# Altium schematic sheet Power.SchDoc: Power
size A3; ApprovedBy: Diogo Gomes; CheckedBy: Bruno, Candido, Pedro; Author: João Vieira; CompanyName: LART; DrawnBy: João Vieira; Organization: LART; Address1: Morro do lena; Address2: Alto Do Vieiro; Address3: APT 4163, Building D; Revision: v1.4.2; SheetNumber: 8; SheetTotal: 12; ProjectTitle: Autonomous Control Unit; CheckedBy1: G. Candido; CheckedBy2: F. Chen; CheckedBy3: P. Ferreira; CheckedBy4: B. Vicente; CheckedBy5: _; CheckedBy6: _; CheckedBy7: _; CHK_APP_DATE: --/--/--; DSN_APP_DATE: --/--/--; ENG_APP_DATE: --/--/--; Summary: Includes the various reference voltages needed to power all the chips in the ACU; version_tag: 1.4.2; SPICEModelCacheBATJKBWV: <root> / <DocumentId>BATJKBWV</DocumentId> / <CacheFrame Number="0"> / <Model Name="1280_74477005_5.6u" Kind="CKT"> / <Text>******* / .subckt 1280_74477005_5.6u 1 2 / Rp 1 2 5511 / Cp 1 2 8p / Rs 1 N3 0.0105 / L1 N3 2 5.464u / .ends 1280_74477005_5.6u</Text> / </Model> / <Model Name="865060440001_10uf" Kind="CKT"> / <Text>******* / .subckt 865060440001_10uF 1 2 / Rser 1 3 1.81968584275 / Lser 2 4 1.435032181E-09 / C1 3 4 0.00001 / Rpar 3 4 8333333.33333333 / .ends 865060440001_10uF</Text> / </Model> / </CacheFrame> / </root>; ImagePath: C:\Users\micron\Desktop
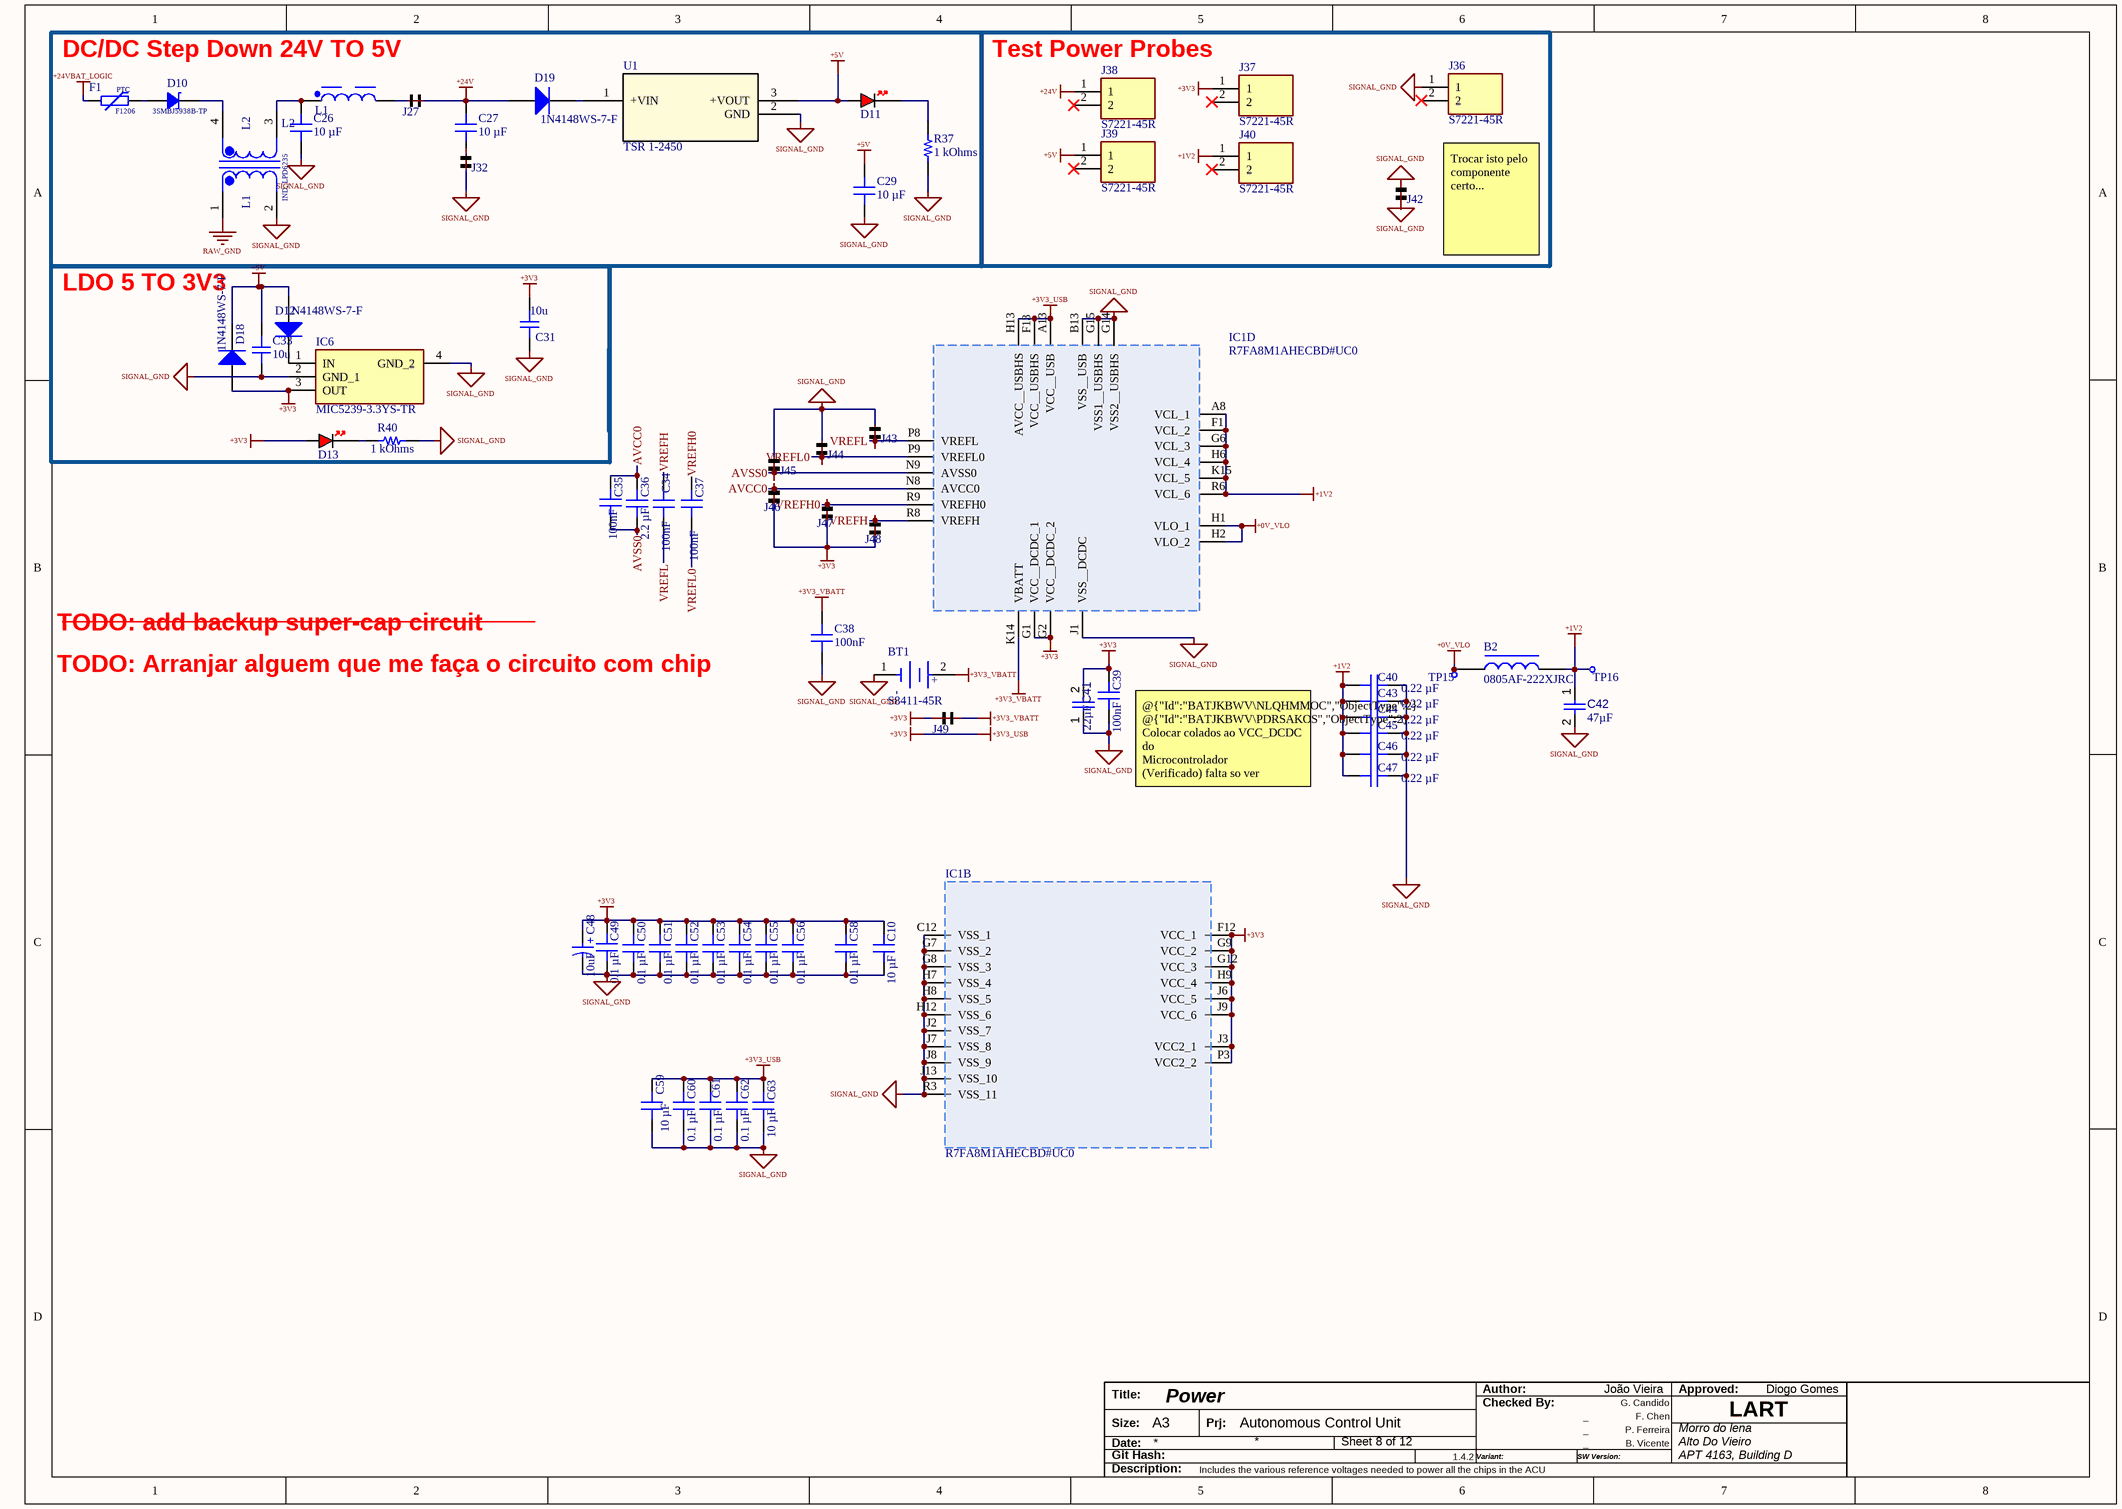
[diagram p0: Power.SchDoc]

## Parts
B2  0805AF-222XJRC  [INDC2317X152N]
BT1  S8411-45R  [FP-S8411-45R-MFG]
C10  value 10 µF  [CAP 0805_2012]  (hidden comment: 0.1uF 0805)
C26  10 µF  [CAP 0805_2012]
C27  10 µF  [CAP 0805_2012]
C29  10 µF  [CAP 0805_2012]
C31  10u  [CAP_0805]
C33  10u  [CAP_0805]
C34  value 100nF  [CAP 0805_2012]  (hidden comment: 0.1uF)
C35  value 100nF  [CAP 0805_2012]  (hidden comment: 0.1uF)
C36  value 2.2 µF  [CAP 0805_2012]  (hidden comment: 2.2uF)
C37  value 100nF  [CAP 0805_2012]  (hidden comment: 0.1uF)
C38  value 100nF  [CAP 0805_2012]  (hidden comment: 0.1uF)
C39  value 100nF  [CAP 0805_2012]  (hidden comment: 0.1uF)
C40  0.22 µF  [CAP 0201_0603]
C41  value 22µF  [CAPC0805(2012)145_L]  (hidden comment: Capacitor 22µF +/-40% 16V 0805)
C42  value 47µF  [CAPC0805(2012)145_L]  (hidden comment: 47uF)
C43  0.22 µF  [CAP 0201_0603]
C44  0.22 µF  [CAP 0201_0603]
C45  0.22 µF  [CAP 0201_0603]
C46  0.22 µF  [CAP 0201_0603]
C47  0.22 µF  [CAP 0201_0603]
C48  10uF  [WCAP-ASLL_D4H5.5]
C49  0.1 µF  [CAP 0201_0603]
C50  0.1 µF  [CAP 0201_0603]
C51  0.1 µF  [CAP 0201_0603]
C52  0.1 µF  [CAP 0201_0603]
C53  0.1 µF  [CAP 0201_0603]
C54  0.1 µF  [CAP 0201_0603]
C55  0.1 µF  [CAP 0201_0603]
C56  0.1 µF  [CAP 0201_0603]
C58  0.1 µF  [CAP 0201_0603]
C59  value 10 µF  [CAP 0805_2012]  (hidden comment: 10uF)
C60  0.1 µF  [CAP 0201_0603]
C61  0.1 µF  [CAP 0201_0603]
C62  0.1 µF  [CAP 0201_0603]
C63  value 10 µF  [CAP 0805_2012]  (hidden comment: 10uF)
D10  3SMBJ5938B-TP  [DO214AA SMB]
D11  RED  [LED_0603_RED]  (value not drawn)
D12  1N4148WS-7-F  [DIOD-SOD323-2-A_V]
D13  RED  [LED_0603_RED]  (value not drawn)
D18  1N4148WS-7-F  [DIOD-SOD323-2-A_V]
D19  1N4148WS-7-F  [DIOD-SOD323-2-A_V]
F1  F1206  [FUSE_1206]
IC1  R7FA8M1AHECBD#UC0  [RA8M1_BGA]  (parts B,D of 6)
IC6  MIC5239-3.3YS-TR  [SOT230P700X180-4N]
J27  A solder Bridge  [Solder Bridge 805]  (value not drawn)
J32  A solder Bridge  [Solder Bridge 805]  (value not drawn)
J36  S7221-45R  [S722145R]
J37  S7221-45R  [S722145R]
J38  S7221-45R  [S722145R]
J39  S7221-45R  [S722145R]
J40  S7221-45R  [S722145R]
J42  A solder Bridge  [Solder Bridge 805]  (value not drawn)
J43  A solder Bridge  [Solder Bridge 805]  (value not drawn)
J44  A solder Bridge  [Solder Bridge 805]  (value not drawn)
J45  A solder Bridge  [Solder Bridge 805]  (value not drawn)
J46  A solder Bridge  [Solder Bridge 805]  (value not drawn)
J47  A solder Bridge  [Solder Bridge 805]  (value not drawn)
J48  A solder Bridge  [Solder Bridge 805]  (value not drawn)
J49  A solder Bridge  [Solder Bridge 805 Open]  (value not drawn)
L1  5.6uH, 8.7A  [WE-PD_1280]  (value not drawn)
L2  IND_LPD6235  [IND_LPD6235]
R37  1 kOhms  [RES 0805_2012]
R40  1 kOhms  [RES 0805_2012]
TP15  TestPad  [Test Pad Small]  (value not drawn)
TP16  TestPad  [Test Pad Small]  (value not drawn)
U1  TSR 1-2450  [TSR1-SINGLE_TRP]

## Blocks framed on the sheet
DC/DC Step Down 24V TO 5V: C26 C27 C29 D10 D11 D19 F1 J27 J32 L1 L2 R37 U1
Test Power Probes: J36-J40 J42
LDO 5 TO 3V3: C31 C33 D12 D13 D18 IC6 R40

## Nets
+0V_VLO: B2.1 IC1.H1(VLO_1) IC1.H2(VLO_2) TP15.P2
+1V2: B2.2 C40.1 C42.1 C43.1 C44.1 C45.1 C46.1 C47.1 IC1.A8(VCL_1) IC1.F1(VCL_2) IC1.G6(VCL_3) IC1.H6(VCL_4) IC1.K15(VCL_5) IC1.R6(VCL_6) J40.1 TP16.P2
+3V3: C10.2 C31.2 C39.2 C41.2 C48.1(P) C49.2 C50.2 C51.2 C52.2 C53.2 C54.2 C55.2 C56.2 C58.2 C59.2 C60.2 C61.2 C62.2 C63.2 D13.A D18.1(A) IC1.A13(VCC__USB) IC1.F12(VCC_1) IC1.F13(VCC__USBHS) IC1.G1(VCC__DCDC_1) IC1.G2(VCC__DCDC_2) IC1.G9(VCC_2) IC1.G12(VCC_3) IC1.H9(VCC_4) IC1.H13(AVCC__USBHS) IC1.J3(VCC2_1) IC1.J6(VCC_5) IC1.J9(VCC_6) IC1.P3(VCC2_2) IC6.3(OUT) J37.1 J46.P0 J47.P0 J48.P0 J49.P0  [also labelled +3V3_USB]
+3V3_VBATT: BT1.2(A) C38.2 IC1.K14(VBATT) J49.P1
+5V: C29.2 C33.2 D11.A D12.1(A) D18.2(K) J39.1 U1.3(+VOUT)
+24V: C27.2 D19.1(A) J27.P0 J38.1
+24VBAT_LOGIC: F1.1
RAW_GND: L2.1
SIGNAL_GND: BT1.1(C) C10.1 C26.1 C29.1 C31.1 C33.1 C38.1 C39.1 C40.2 C41.1 C42.2 C43.2 C44.2 C45.2 C46.2 C47.2 C48.2(N) C49.1 C50.1 C51.1 C52.1 C53.1 C54.1 C55.1 C56.1 C58.1 C59.1 C60.1 C61.1 C62.1 C63.1 IC1.B13(VSS__USB) IC1.C12(VSS_1) IC1.G7(VSS_2) IC1.G8(VSS_3) IC1.G14(VSS2__USBHS) IC1.G15(VSS1__USBHS) IC1.H7(VSS_4) IC1.H8(VSS_5) IC1.H12(VSS_6) IC1.J1(VSS__DCDC) IC1.J2(VSS_7) IC1.J7(VSS_8) IC1.J8(VSS_9) IC1.J13(VSS_10) IC1.R3(VSS_11) IC6.2(GND_1) IC6.4(GND_2) J32.P0 J36.1 J42.P0 J42.P1 J43.P1 J44.P1 J45.P1 L2.2 R37.1 R40.2 U1.2(GND)
AVCC0: C35.2 C36.2 IC1.N8(AVCC0) J46.P1
AVSS0: C35.1 C36.1 IC1.N9(AVSS0) J45.P0
VREFH: C34.2 IC1.R8(VREFH) J48.P1
VREFH0: C37.2 IC1.R9(VREFH0) J47.P1
VREFL: C34.1 IC1.P8(VREFL) J43.P0
VREFL0: C37.1 IC1.P9(VREFL0) J44.P0
NetC26_2: C26.2 L1.1 L2.3
NetC27_1: C27.1 J32.P1
NetD10_1: D10.1 F1.2
NetD10_2: D10.2 L2.4
NetD11_K: D11.K R37.2
NetD12_2: D12.2(K) IC6.1(IN)
NetD13_K: D13.K R40.1
NetD19_2: D19.2(K) U1.1(+VIN)
NetJ27_P1: J27.P1 L1.2

Not connected (* = marked no-connect by the designer): J36 2*; J37 2*; J38 2*; J39 2*; J40 2*

## Notes on the sheet
- Trocar isto pelo componente certo...
- TODO: add backup super-cap circuit
- TODO: Arranjar alguem que me faça o circuito com chip
- (near C39) @{"Id":"BATJKBWV\NLQHMMOC","ObjectType":2} @{"Id":"BATJKBWV\PDRSAKOS","ObjectType":2} Colocar colados ao VCC_DCDC do
  Microcontrolador
  (Verificado) falta so ver datasheet para ver se foi erro da renesas
- Title:
- Author:
- Checked By:
- Approved:
- Size:
- Date:
- Git Hash:
- A3
- Prj:
- Variant:
- SW Version:
- Description:
- (in symbol 865060440001) +
- (in symbol CMP-00029-00001-1) +; -
- (in symbol FUSE_PPTC_1206) PTC
- (in symbol IND_LPD6235) L1

## Library data of the parts
B2 = 0805AF-222XJRC: COILCRAFT - 0805AF-222XJRC - Wirewound Inductor, 2.2 H, 0.98 ohm, 105 MHz, 350 mA, 0805 [2012 Metric], 0805AF Series; Geometry.Height: 1.52mm; Manufacturer_Name: COILCRAFT; Manufacturer_Part_Number: 0805AF-222XJRC; Mouser Part Number: *; Mouser Price/Stock: *; Arrow Part Number: *; Arrow Price/Stock: *; Datasheet Link: https://4donline.ihs.com/images/VipMasterIC/IC/COLC/COLC-S-A0013795668/COLC-S-A0013956448-1.pdf?hkey=6D3A4C79FDBF58556ACFDE234799DDF0
BT1 = CMP-00029-00001-1: Batteries/Accessories; RoHS Compliant: Yes
C10 C59 C63 = C2012X7R1A106K125AE: CAP CER 10UF 10V X7R 0805; manufacturer: TDK Corporation; Tolerance: ±10%; Part Number: C2012X7R1A106K125AE; Applications: Boardflex Sensitive; Capacitance: 10 µF; componentlink1description: Datasheet; componentlink1url: https://product.tdk.com/info/en/catalog/datasheets/mlcc_commercial_soft_en.pdf?ref_disty=digikey; componentlink2description: DigiKey Link; componentlink2url: https://www.digikey.com/en/products/detail/tdk-corporation/C2012X7R1A106K125AE/5809181; Device Package: 0805 (2012 Metric); Features: Soft Termination; lastupdated: 30/01/2024 20:15:17; Lifecycle Status: Active; Minimum Order: 1; Mounting Type: Surface Mount, MLCC; Operating Temperature: -55°C ~ 125°C; Package / Case: 0805 (2012 Metric); packaging: TapeAndReel; partid: 3036; Part Status: Active; price: 0.07; series: C; Size / Dimension: 0.079" L x 0.049" W (2.00mm x 1.25mm); Supplier 1: DigiKey; Supplier Part Number 1: 445-173616-1-ND; Temperature Coefficient: X7R; Thickness (Max): 0.059" (1.50mm); Voltage - Rated: 10V
C26 C27 C29 = CL21Y106KPQVPNE: CAP CER 10UF 10V X7S 0805; manufacturer: Samsung Electro-Mechanics; Tolerance: ±10%; Part Number: CL21Y106KPQVPNE; Value: 10 µF; Applications: Automotive; Capacitance: 10 µF; componentlink1description: Datasheet; componentlink1url: http://www.samsungsem.com/kr/support/product-search/mlcc/CL21Y106KPQVPNE.jsp; componentlink2description: DigiKey Link; componentlink2url: https://www.digikey.com/en/products/detail/samsung-electro-mechanics/CL21Y106KPQVPNE/5961169; Device Package: 0805 (2012 Metric); lastupdated: 06/02/2024 20:15:48; Lifecycle Status: Active; Minimum Order: 1; Mounting Type: Surface Mount, MLCC; Operating Temperature: -55°C ~ 125°C; Package / Case: 0805 (2012 Metric); packaging: TapeAndReel; partid: 2979; Part Status: Active; price: 0.06; Ratings: AEC-Q200; series: CL; Size / Dimension: 0.079" L x 0.049" W (2.00mm x 1.25mm); Supplier 1: DigiKey; Supplier Part Number 1: 1276-6685-1-ND; Temperature Coefficient: X7S; Thickness (Max): 0.055" (1.40mm); Voltage - Rated: 10V
C31 C33 = CAP_0805_10V: Capacitor SMD 0805 10V
C34 C35 C37-C39 = C2012X7R1A106K125AE: CAP CER 10UF 10V X7R 0805; manufacturer: TDK Corporation; Capacitance: 10 µF; Tolerance: ±10%; Part Number: C2012X7R1A106K125AE; Applications: Boardflex Sensitive; componentlink1description: Datasheet; componentlink1url: https://product.tdk.com/info/en/catalog/datasheets/mlcc_commercial_soft_en.pdf?ref_disty=digikey; componentlink2description: DigiKey Link; componentlink2url: https://www.digikey.com/en/products/detail/tdk-corporation/C2012X7R1A106K125AE/5809181; Device Package: 0805 (2012 Metric); Features: Soft Termination; lastupdated: 30/01/2024 20:15:17; Lifecycle Status: Active; Minimum Order: 1; Mounting Type: Surface Mount, MLCC; Operating Temperature: -55°C ~ 125°C; Package / Case: 0805 (2012 Metric); packaging: TapeAndReel; partid: 3036; Part Status: Active; price: 0.07; series: C; Size / Dimension: 0.079" L x 0.049" W (2.00mm x 1.25mm); Supplier 1: DigiKey; Supplier Part Number 1: 445-173616-1-ND; Temperature Coefficient: X7R; Thickness (Max): 0.059" (1.50mm); Voltage - Rated: 10V
C36 = VJ0805V225MXQTW1BC: CAP CER 2.2UF 10V Y5V 0805; manufacturer: Vishay Vitramon; Temperature Coefficient: Y5V (F); Tolerance: ±20%; Part Number: VJ0805V225MXQTW1BC; Applications: General Purpose; Capacitance: 2.2 µF; componentlink1description: Datasheet; componentlink1url: https://www.vishay.com/docs/28548/vjw1bcbascomseries.pdf; componentlink2description: DigiKey Link; componentlink2url: https://www.digikey.com/en/products/detail/vishay-vitramon/VJ0805V225MXQTW1BC/8310634; Device Package: 0805 (2012 Metric); lastupdated: 04/02/2024 20:15:35; Lifecycle Status: Active; Minimum Order: 1; Mounting Type: Surface Mount, MLCC; Operating Temperature: -25°C ~ 85°C; Package / Case: 0805 (2012 Metric); packaging: TapeAndReel; partid: 26419; Part Status: Active; price: 0.06; series: VJ; Size / Dimension: 0.079" L x 0.049" W (2.00mm x 1.25mm); Supplier 1: DigiKey; Supplier Part Number 1: 720-VJ0805V225MXQTW1BCCT-ND; Thickness (Max): 0.053" (1.35mm); Voltage - Rated: 10V
C40 C43-C47 = GMC02X5R224K16NT: CAP0201 X5R .22UF 10% 16V; manufacturer: Cal-Chip Electronics, Inc.; Value: 0.22 µF; Tolerance: ±10%; Part Number: GMC02X5R224K16NT; Applications: General Purpose; Capacitance: 0.22 µF; componentlink1description: Datasheet; componentlink1url: https://calchip.com/wp-content/uploads/2024/02/gmc_series-1.pdf; componentlink2description: DigiKey Link; componentlink2url: https://www.digikey.com/en/products/detail/cal-chip-electronics-inc/GMC02X5R224K16NT/22562848; Device Package: 0201 (0603 Metric); lastupdated: 04/06/2024 19:00:50; Lifecycle Status: Active; Minimum Order: 1; Mounting Type: Surface Mount, MLCC; Operating Temperature: -55°C ~ 85°C; Package / Case: 0201 (0603 Metric); packaging: TapeAndReel; partid: 57532; price: 0.01; series: GMC; Size / Dimension: 0.024" L x 0.012" W (0.60mm x 0.30mm); Supplier 1: DigiKey; Supplier Part Number 1: 4713-GMC02X5R224K16NTCT-ND; Temperature Coefficient: X5R; Thickness (Max): 0.013" (0.33mm); Voltage - Rated: 16V
C41 = CMP-001-00081-4: Chip Capacitor, 22µF +/-40%, 16V, 0805, Thickness 1.45 mm; Tolerance: 5%; Voltage Rating: 16V; Mounting Technology: SMT; Pins: 2; Max Operating Temperature: 85°C; Case/Package: 0805; Min Operating Temperature: -55°C
C42 = CMP-001-00082-4: Chip Capacitor, 47µF +/-40%, 6.3V, 0805, Thickness 1.45 mm; Tolerance: 10%; Min Operating Temperature: -55°C; Max Operating Temperature: 85°C; Case/Package: 0805; Pins: 2; Mounting Technology: SMT; Voltage Rating: 6.3V
C48 = 865060440001: WCAP-ASLL Aluminum Electrolytic Capacitor, V-Chip, D4 x H5.5mm, 10µF, 25V; Manufacturer: Wurth Elektronik; Capacitance Tolerance: +/-20%; Dissipation Factor: 14%; Endurance: 2000h; Leakage Current: 3uA; Ripple Current: 90mA; Technical Reference: ASEB055100M025DVCTAB000; Manufacturer Part Number: 865060440001; Category: Aluminum Electrolytic Capacitors; Match Code: WCAP-ASLL; ComponentLink1Description: Website Link; ComponentLink1URL: https://www.we-online.com/redexpert/article/865060440001?ad; ComponentLink2Description: Datasheet Link; ComponentLink2URL: https://www.we-online.com/redexpert/spec/865060440001?ad; Mount: Surface Mount; Operating Temperature Max: 105°C; Operating Temperature Min: -55°C; Packaging: Tape and Reel; Height: 5.5mm; Diameter: 4mm; Capacitance: 10uF; Rated Voltage (DC): 25V
C49-C56 C58 = EMK063BJ104KP-F: CAP CER 0.1UF 16V X5R 0201; manufacturer: Taiyo Yuden; Tolerance: ±10%; Value: 0.1 µF; Part Number: EMK063BJ104KP-F; Applications: SMPS Filtering; Capacitance: 0.1 µF; componentlink1description: Datasheet; componentlink1url: https://ds.yuden.co.jp/TYCOMPAS/ut/detail?pn=EMK063BJ104KP-F  &u=M; componentlink2description: DigiKey Link; componentlink2url: https://www.digikey.com/en/products/detail/taiyo-yuden/EMK063BJ104KP-F/4970625; Device Package: 0201 (0603 Metric); lastupdated: 04/06/2024 19:01:11; Lifecycle Status: Active; Minimum Order: 1; Mounting Type: Surface Mount, MLCC; Operating Temperature: -55°C ~ 85°C; Package / Case: 0201 (0603 Metric); packaging: TapeAndReel; partid: 12; price: 0.01; series: M; Supplier 1: DigiKey; Supplier Part Number 1: 587-5833-1-ND; Temperature Coefficient: X5R; Voltage - Rated: 16V; Size / Dimension: 0.024" L x 0.012" W (0.60mm x 0.30mm); Thickness (Max): 0.013" (0.33mm); Part Status: Active
C60-C62 = 02016C104KAT2A: 0201 6.3V X7R 100NF 10%; manufacturer: KYOCERA AVX; Value: 0.1 µF; Part Number: 02016C104KAT2A; Applications: General Purpose; Capacitance: 0.1 µF; componentlink1description: Datasheet; componentlink1url: https://datasheets.kyocera-avx.com/X7RDielectric.pdf; componentlink2description: DigiKey Link; componentlink2url: https://www.digikey.com/en/products/detail/kyocera-avx/02016C104KAT2A/17868582; Device Package: 0201 (0603 Metric); lastupdated: 04/06/2024 19:00:59; Lifecycle Status: Active; Minimum Order: 1; Mounting Type: Surface Mount, MLCC; Operating Temperature: -55°C ~ 125°C; Package / Case: 0201 (0603 Metric); packaging: TapeAndReel; partid: 47559; price: 0.06; series: -; Supplier 1: DigiKey; Supplier Part Number 1: 478-02016C104KAT2ACT-ND; Temperature Coefficient: X7R; Tolerance: ±10%; Voltage - Rated: 6.3V; Size / Dimension: 0.024" L x 0.012" W (0.60mm x 0.30mm); Thickness (Max): 0.013" (0.33mm); Part Status: Active
D10 = 3SMBJ5938B-TP: DIODE ZENER 36V 3W DO214AA; Manufacturer: Micro Commercial Co; Current - Reverse Leakage @ Vr: 1 µA @ 27.4 V; Impedance (Max) (Zzt): 38 Ohms; Tolerance: ±5%; Voltage - Forward (Vf) (Max) @ If: 1.5 V @ 200 mA; Part Number: 3SMBJ5938B-TP; ComponentLink1Description: Datasheet; ComponentLink1URL: https://www.mccsemi.com/pdf/Products/3SMBJ5913B~3SMBJ5943B(DO-214AA).pdf; ComponentLink2Description: DigiKey Link; ComponentLink2URL: https://www.digikey.com/en/products/detail/micro-commercial-co/3SMBJ5938B-TP/1114251; LastUpdated: 06/02/2024 21:26:34; Lifecycle Status: Active; Minimum Order: 1; Mounting Type: Surface Mount; Operating Temperature: -55°C ~ 150°C; Package / Case: DO-214AA, SMB; Packaging: TapeAndReel; PartId: 926; Part Status: Active; Power - Max: 3 W; Price: 0.07; Series: -; Supplier 1: DigiKey; Supplier Part Number 1: 3SMBJ5938BTPMSCT-ND; Supplier Device Package: DO-214AA (SMB); Voltage - Zener (Nom) (Vz): 36 V
D11 D13 = LED_0603_RED: LED 0603 RED SMD
D12 D18 D19 = CMP-004-00002-2: Fast Switching Diode, 75 V, 0.3 A, -65 to 150 degC, 2-Pin SOD323, RoHS, Tape and Reel; Manufacturer: Diodes Inc; Peak Reverse Current: 1uA; Max Surge Current: 2A; Elements: 1; Forward Current: 300mA; Recovery Time: 4ns; Forward Voltage: 1.25V; Datasheet Version: Rev. 25-2, 03/2016; Case/Package: SOD; Min Operating Temperature: -65°C; RoHS Compliant: True; Max Operating Temperature: 150°C; Manufacturer URL: http://www.diodes.com/; Pins: 2; Package Quantity: 3000; Datasheet URL: http://www.diodes.com/datasheets/ds30097.pdf; Packaging: TapeandReel; Package Description: 2-Pin Small Outline Diode, Body 1.7 x 1.3 mm; Mounting Technology: SM; Package Reference: SOD323-2
F1 = FUSE_PPTC_1206: Fuse PPTC SMD 1206; Manufacturer: *; Manufacturer Part Number: *
IC1 = R7FA8M1AHECBD#UC0: Integrated Circuit; Manufacturer_Name: Renesas Electronics; Datasheet Link: https://www.renesas.com/us/en/document/dst/ra8m1-group-datasheet?r=25447396; Height: 1.47mm; Manufacturer_Part_Number: R7FA8M1AHECBD#UC0; Mouser Part Number: 968-R7FA8M1AHECBDUC0; Mouser Price/Stock: https://www.mouser.co.uk/ProductDetail/Renesas-Electronics/R7FA8M1AHECBDUC0?qs=HoCaDK9Nz5en4LBg9VyLXw%3D%3D
IC6 = MIC5239-3.3YS-TR: Integrated Circuit; Manufacturer_Name: Microchip; Datasheet Link: https://ww1.microchip.com/downloads/en/DeviceDoc/mic5239.pdf; Height: 1.8mm; Manufacturer_Part_Number: MIC5239-3.3YS-TR; Mouser Part Number: 998-MIC5239-3.3YSTR; Mouser Price/Stock: https://www.mouser.co.uk/ProductDetail/Microchip-Technology-Micrel/MIC5239-33YS-TR?qs=U6T8BxXiZAXN0UitWWB92A%3D%3D; Arrow Part Number: MIC5239-3.3YS-TR; Arrow Price/Stock: https://www.arrow.com/en/products/mic5239-3.3ys-tr/microchip-technology?region=nac
J27 J32 J42-J48 = Solder Bridge 805
J36-J40 = S7221-45R: EMI Gaskets, Sheets, Absorbers & Shielding EMC Spring Contact 1.23mm high; Manufacturer_Name: Harwin; Manufacturer_Part_Number: S7221-45R; Mouser Part Number: 855-S7221-45R; Mouser Price/Stock: https://www.mouser.co.uk/ProductDetail/Harwin/S7221-45R?qs=pffCcXpkxLxI%252B2oy4ryQHw%3D%3D; Arrow Part Number: *; Arrow Price/Stock: *; Datasheet Link: https://cdn.harwin.com/pdfs/S7221-45R.pdf; Geometry.Height: 1.23mm
J49 = Solder Bridge 805 Open
L1 = 74477005: WE-PD SMT Power Inductor, size 1280, 5.6uH, 8.7A, 13.5mOhm; Manufacturer: Wurth Elektronik; Case/Size Code: 1280; DC Resistance: 10.5mOhm; Saturation Current: 10A; Self Resonant Frequency: 24MHz; Type: Standard; Manufacturer Part Number: 74477005; Category: Power Inductors; Match Code: WE-PD; ComponentLink1Description: Website Link; ComponentLink1URL: https://www.we-online.com/redexpert/article/74477005?ad; ComponentLink2Description: Datasheet Link; ComponentLink2URL: https://www.we-online.com/redexpert/spec/74477005?ad; Mount: Surface Mount; Operating Temperature Max: 125°C; Operating Temperature Min: -40°C; Packaging: Tape and Reel; Length: 12mm; Width: 12mm; Height: 8mm; DC Resistance Max: 13.5mOhm; Inductance: 5.6uH; Rated Current: 8.7A
R37 R40 = RNCS0805BKE1K00: RES 1K OHM 0.1% 1/10W 0805; Manufacturer: Stackpole Electronics Inc; Power (Watts): 0.1W, 1/10W; Temperature Coefficient: ±25ppm/°C; Part Number: RNCS0805BKE1K00; Value: 1 kOhms; ComponentLink1Description: Datasheet; ComponentLink1URL: https://www.seielect.com/catalog/sei-rncs_rnch.pdf; ComponentLink2Description: DigiKey Link; ComponentLink2URL: https://www.digikey.com/en/products/detail/stackpole-electronics-inc/RNCS0805BKE1K00/1800073; Composition: Thin Film; Device Package: 0805 (2012 Metric); Features: Anti-Corrosive, Automotive AEC-Q200, Moisture Resistant; Height - Seated (Max): 0.026" (0.65mm); LastUpdated: 02/02/2024 21:00:48; Lifecycle Status: Active; Minimum Order: 1; Number of Terminations: 2; Operating Temperature: -55°C ~ 155°C; Package / Case: 0805 (2012 Metric); Packaging: TapeAndReel; PartId: 27715; Part Status: Active; Price: 0.07; Ratings: AEC-Q200; Resistance: 1 kOhms; Series: RNCS; Size / Dimension: 0.079" L x 0.049" W (2.00mm x 1.25mm); Supplier 1: DigiKey; Supplier Part Number 1: RNCS0805BKE1K00CT-ND; Supplier Device Package: 0805; Tolerance: ±0.1%
U1 = TSR 1-2450: No Description Available; Mfr_Name: Traco Power; Copyright: Copyright (C) 2024 Ultra Librarian. All rights reserved.; Manufacturer_Part_Number: TSR 1-2450; RefDes: RefDes; Type: DEV